# EAGLE design Active_rectifier (EAGLE 8.3.2)
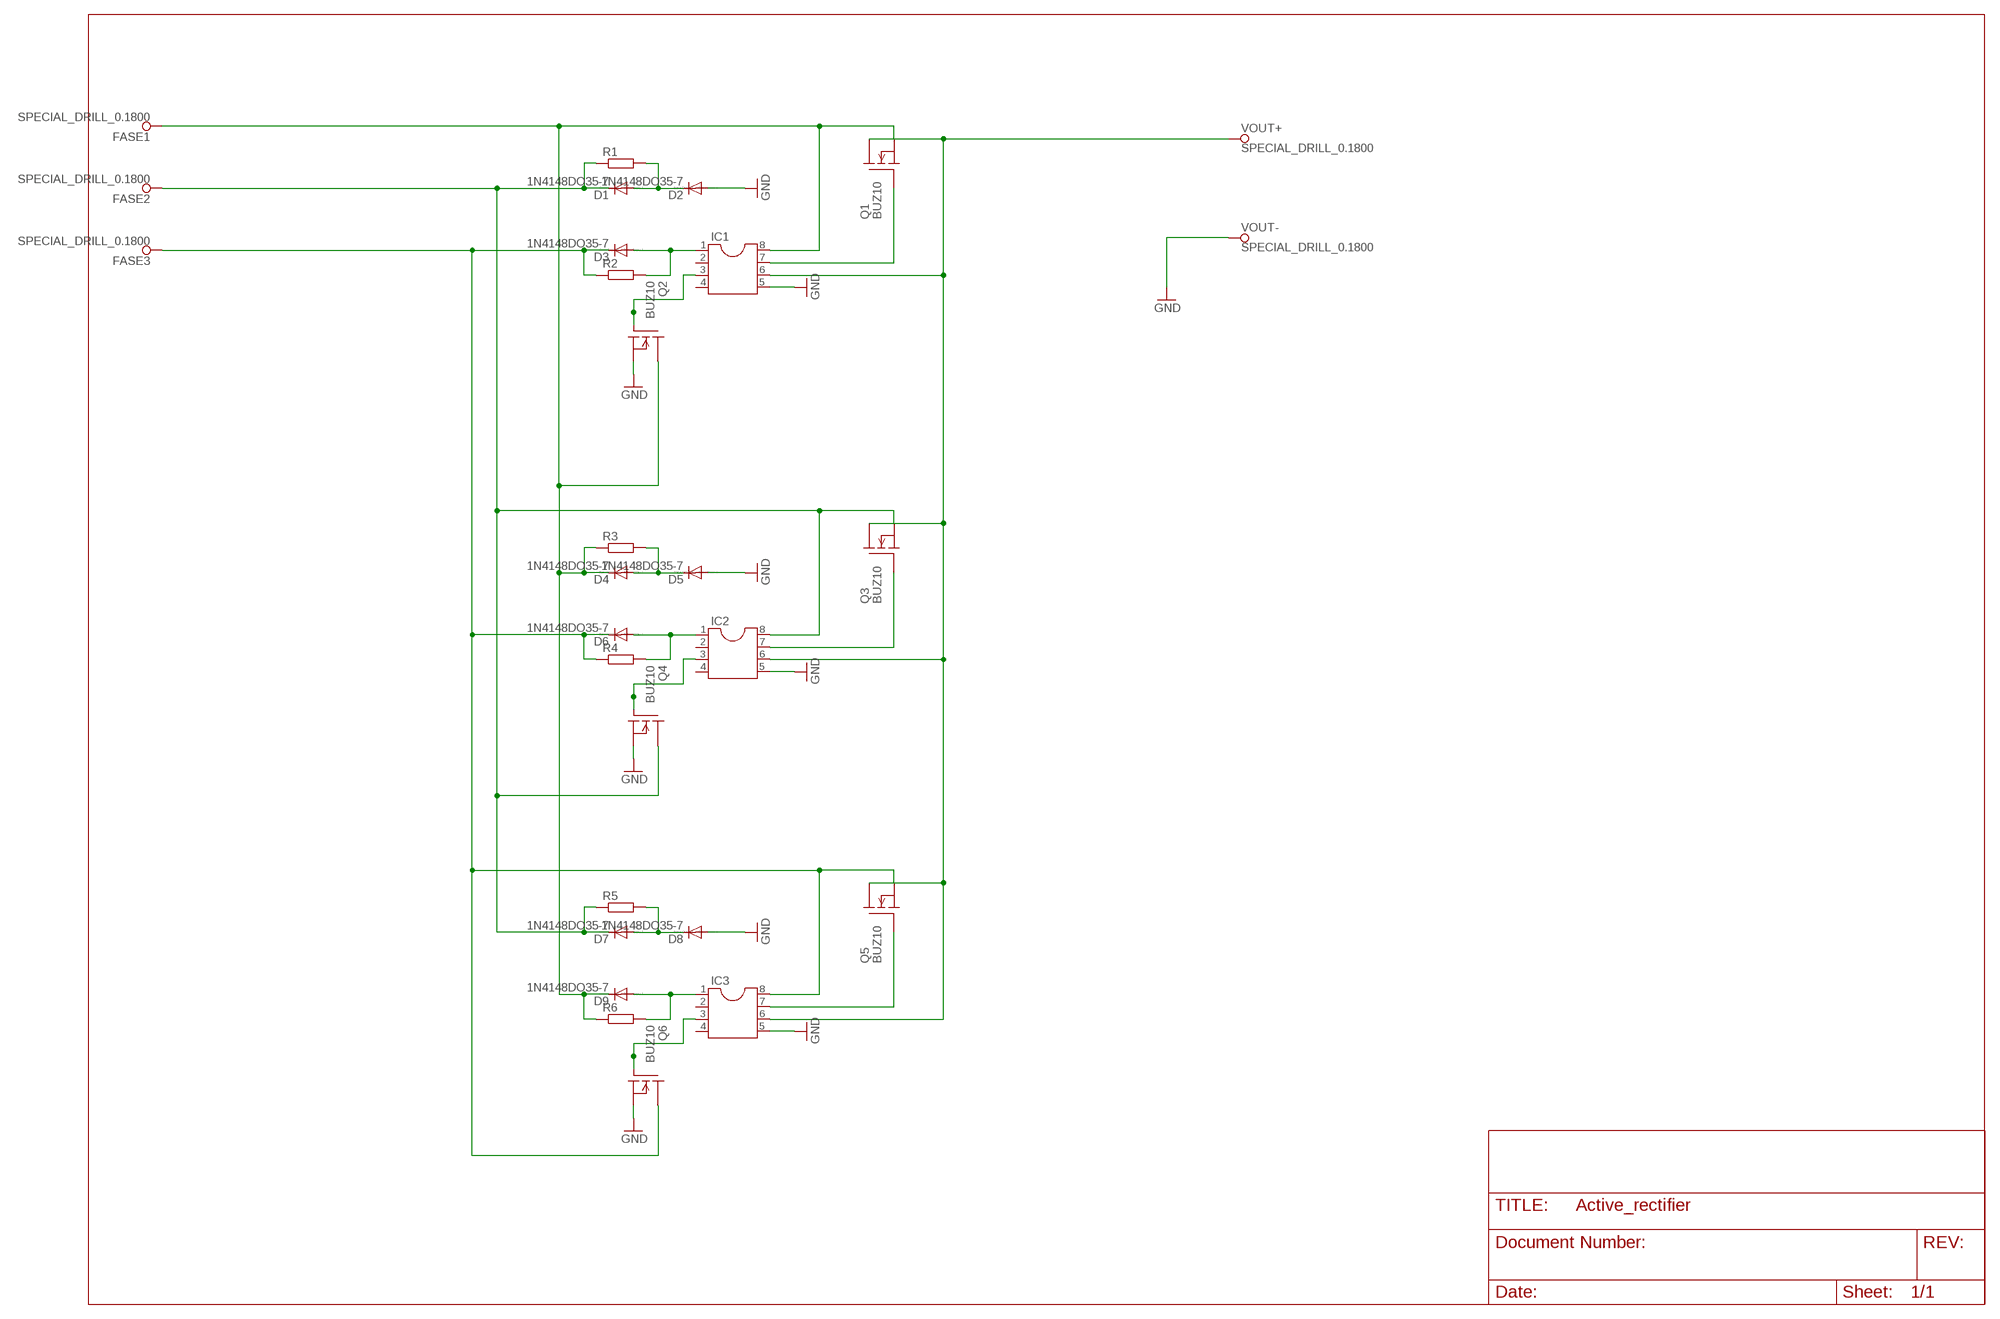
[diagram p0: schematic, sheet 1]

## Parts
D1  1N4148DO35-7  [DO35-7]
D2  1N4148DO35-7  [DO35-7]
D3  1N4148DO35-7  [DO35-7]
D4  1N4148DO35-7  [DO35-7]
D5  1N4148DO35-7  [DO35-7]
D6  1N4148DO35-7  [DO35-7]
D7  1N4148DO35-7  [DO35-7]
D8  1N4148DO35-7  [DO35-7]
D9  1N4148DO35-7  [DO35-7]
FASE1  SPECIAL_DRILL_0.1800  [PAD_0.1800]
FASE2  SPECIAL_DRILL_0.1800  [PAD_0.1800]
FASE3  SPECIAL_DRILL_0.1800  [PAD_0.1800]
IC1  DIL8  [DIL08]
IC2  DIL8  [DIL08]
IC3  DIL8  [DIL08]
Q1  BUZ10  [TO220]
Q2  BUZ10  [TO220]
Q3  BUZ10  [TO220]
Q4  BUZ10  [TO220]
Q5  BUZ10  [TO220]
Q6  BUZ10  [TO220]
R1  R-EU_0207/10  [0207/10]
R2  R-EU_0207/10  [0207/10]
R3  R-EU_0207/10  [0207/10]
R4  R-EU_0207/10  [0207/10]
R5  R-EU_0207/10  [0207/10]
R6  R-EU_0207/10  [0207/10]
VOUT+  SPECIAL_DRILL_0.1800  [PAD_0.1800]
VOUT-  SPECIAL_DRILL_0.1800  [PAD_0.1800]

## Nets
GND: D2.A D5.A D8.A IC1.5 IC2.5 IC3.5 Q2.3(S) Q4.3(S) Q6.3(S) VOUT-.1
N$1: D1.A D2.C R1.2
N$2: IC1.7 Q1.1(G)
N$3: D3.A IC1.1 R2.2
N$4: D4.A D5.C R3.2
N$6: IC1.3 Q2.1(G)
N$7: D6.A IC2.1 R4.2
N$8: D3.C D6.C FASE3.1 IC3.8 Q5.3(S) Q6.2(D) R2.1 R4.1
N$9: D7.A D8.C R5.2
N$10: D4.C D9.C FASE1.1 IC1.8 Q1.3(S) Q2.2(D) R3.1 R6.1
N$11: IC2.3 Q4.1(G)
N$12: D9.A IC3.1 R6.2
N$15: IC1.6 IC2.6 IC3.6 Q1.2(D) Q3.2(D) Q5.2(D) VOUT+.1
N$16: IC2.7 Q3.1(G)
N$17: D1.C D7.C FASE2.1 IC2.8 Q3.3(S) Q4.2(D) R1.1 R5.1
N$18: IC3.3 Q6.1(G)
N$20: IC3.7 Q5.1(G)
Unconnected: IC1.2 IC1.4 IC2.2 IC2.4 IC3.2 IC3.4

## Library data of the parts
D1-D9 = diode:1N4148: DIODE high speed (Philips)
FASE1-FASE3 VOUT+ VOUT- = special-drill:SPECIAL_DRILL_: Special drills
IC1-IC3 = ic-package:DIL8: Dual In Line / Socket
Q1-Q6 = transistor-fet:BUZ10: N-Channel Enhancement MOSFET 50V; 20A; 0,080Ohm
R1-R6 = !MyLib:R-EU_: RESISTOR, European symbol

## Board
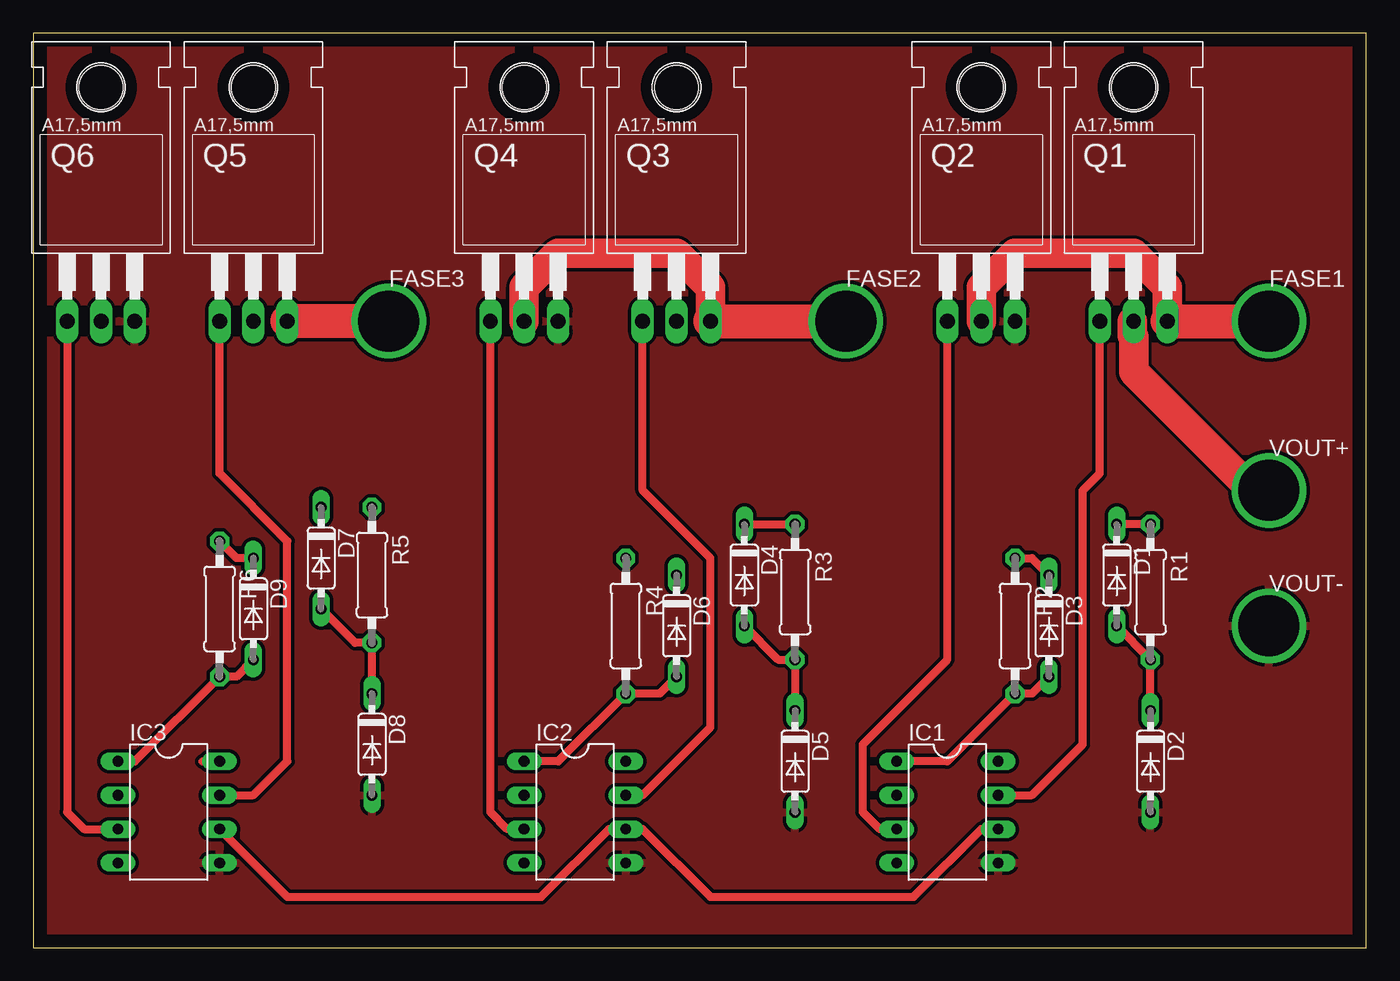
[diagram p1: board, top side]
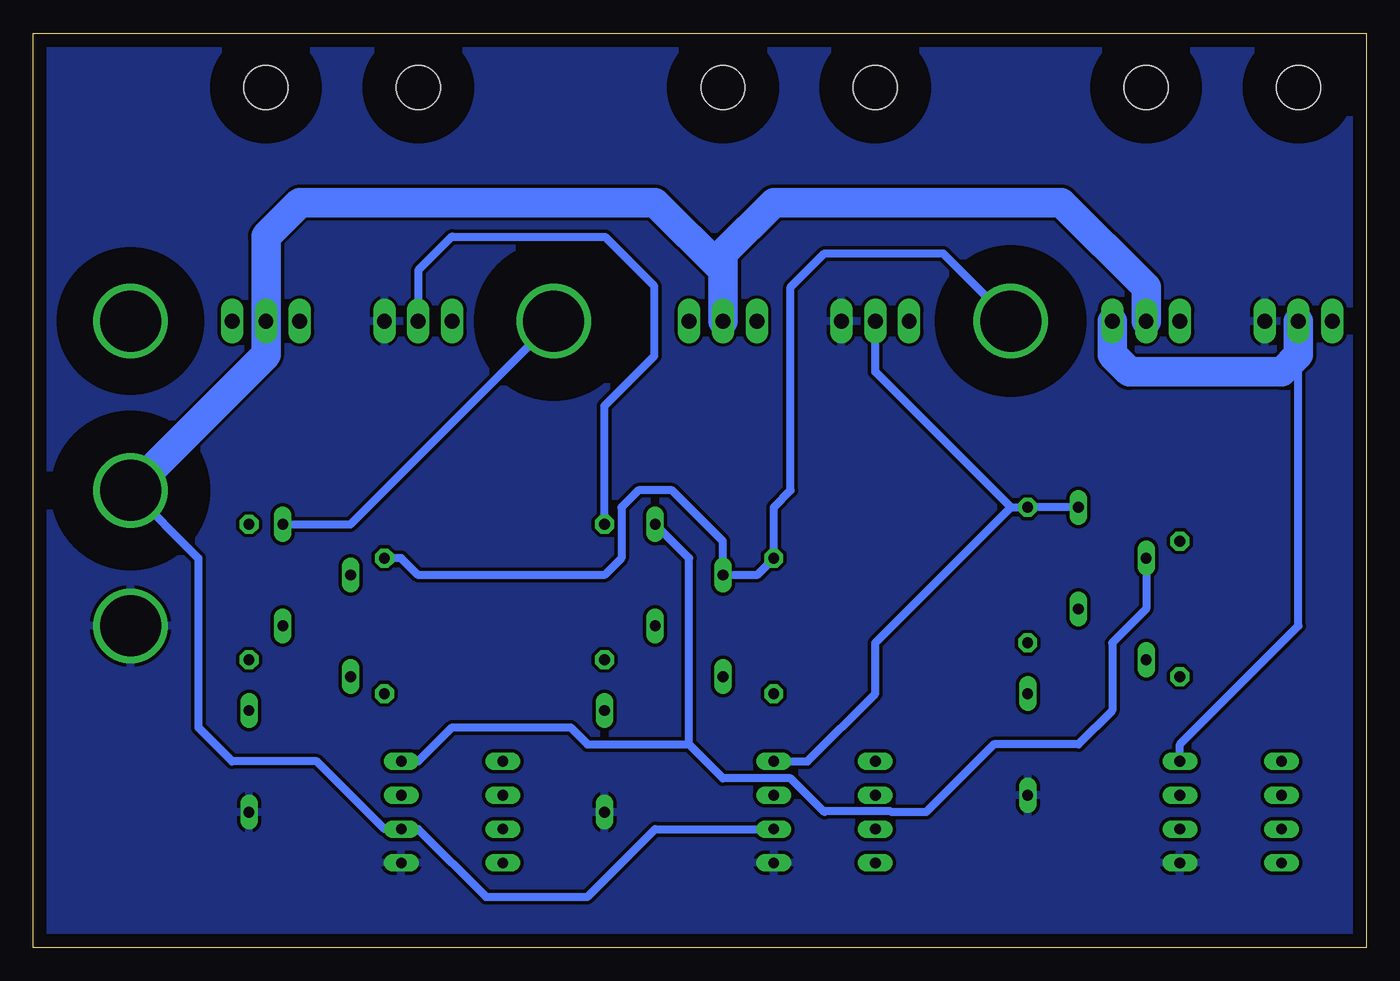
[diagram p2: board, bottom side, seen from below]

Size 100 x 68.57 mm. Coordinates in mm from the lower left corner, seen from the top.
Outline: 0,0 100,0 100,68.57 0,68.57 0,0
Copper layers (1*16): Top 0.035mm / dielectric 1.5mm / Bottom 0.035mm
Design rules "default *": minimum track width 6mil, minimum drill 0.35mm, track to track 10mil, track to pad 10mil, pad to pad 10mil, via to via 10mil, smd to smd 10mil, copper to edge 40mil, drill to drill 6mil, minimum pad ring 10mil, minimum via ring 8mil, stop-mask expansion 4mil, vias tented up to drill 0mil, thermal gap 10mil
bRestrict: area 21.3,41.6 to 32.1,52.4; area 55.3,41.3 to 66.6,52.7; area 87.5,41.8 to 97.9,52.2; area 87,28.6 to 98.4,40

### Footprints (pad centres in the part's own frame; a part is rotated, then mirrored left to right if it is on the bottom)
DO35-7 = drill 0.813 long: A 3.81,0; C -3.81,0
PAD_0.1800 = drill 4.572 pad 4.572: 1 0,0
DIL08 = drill 0.813 long: 1 -3.81,-3.81; 2 -1.27,-3.81; 3 1.27,-3.81; 4 3.81,-3.81; 5 3.81,3.81; 6 1.27,3.81; 7 -1.27,3.81; 8 -3.81,3.81
TO220 = drill 1.118 long: 1 -2.54,-6.35; 2 0,-6.35; 3 2.54,-6.35 | hole 3.302: 0,11.176
0207/10 = drill 0.813 pad 1.422 octagon: 1 -5.08,0; 2 5.08,0

### Placement (x,y rotation side)
D1  81.28,27.94 270 top
D2  83.82,13.97 270 top
D3  76.2,24.13 270 top
D4  53.34,27.94 270 top
D5  57.15,13.97 270 top
D6  48.26,24.13 270 top
D7  21.59,29.21 270 top
D8  25.4,15.24 270 top
D9  16.51,25.4 270 top
FASE1  92.71,46.99 0 top
FASE2  60.96,46.99 0 top
FASE3  26.67,46.99 0 top
IC1  68.58,10.16 270 top
IC2  40.64,10.16 270 top
IC3  10.16,10.16 270 top
Q1  82.55,53.34 0 top
Q2  71.12,53.34 0 top
Q3  48.26,53.34 0 top
Q4  36.83,53.34 0 top
Q5  16.51,53.34 0 top
Q6  5.08,53.34 0 top
R1  83.82,26.67 270 top
R2  73.66,24.13 270 top
R3  57.15,26.67 270 top
R4  44.45,24.13 270 top
R5  25.4,27.94 270 top
R6  13.97,25.4 270 top
VOUT+  92.71,34.29 0 top
VOUT-  92.71,24.13 0 top

### Tracks (layer width: path | path; a pad name or v marks a point on that pad's centre or on a via)
GND
  pour Bottom: 101.6,82.55 101.6,-1.27 -1.27,-1.27 -1.27,82.55
  pour Top: -1.27,81.28 -1.27,-1.27 101.6,-1.27 101.6,81.28
N$1
  Top 0.61: D2.C R1.2 D1.A
N$2
  Top 0.61: IC1.7 74.93,11.43 78.74,15.24 78.74,34.29 80.01,35.56 Q1.1
N$3
  Top 0.61: D3.A 74.93,19.05 R2.2 68.58,13.97 IC1.1
N$4
  Top 0.61: D4.A 55.88,21.59 R3.2 D5.C
N$6
  Top 0.61: IC1.3 63.5,8.89 62.23,10.16 62.23,15.24 68.58,21.59 Q2.1
N$7
  Top 0.61: D6.A 46.99,19.05 R4.2 39.37,13.97 IC2.1
N$8
  Top 0.61: R2.1 74.93,29.21 D3.C | IC3.8 12.7,13.97
  Top 2.54: FASE3.1 Q5.3
  Bottom 0.61: IC3.8 13.97,15.24 5.08,24.13 Q6.2 | R2.1 72.39,29.21 71.12,27.94 57.15,27.94 55.88,29.21 55.88,33.02 54.61,34.29 52.07,34.29 48.26,30.48 D6.C 45.72,27.94 R4.1 44.45,33.02 43.18,34.29 43.18,49.53 40.64,52.07 31.75,52.07 31.11,51.44 30.91,51.23 FASE3.1
  Bottom 2.2: Q6.2 5.08,44.45 6.35,43.18 17.78,43.18 19.05,44.45 Q5.3
N$9
  Top 0.61: D8.C R5.2 24.13,22.86 D7.A
N$10
  Top 0.61: D4.C R3.1 | D9.C 15.24,29.21 R6.1
  Top 2.2: Q2.2 71.12,49.53 73.66,52.07 82.55,52.07 85.09,49.53 Q1.3
  Top 2.54: Q1.3 FASE1.1
  Bottom 0.61: D9.C 16.51,25.4 19.05,22.86 19.05,17.78 21.59,15.24 27.94,15.24 33.02,10.16 35.61,10.16 35.66,10.21 40.59,10.21 40.64,10.16 43.18,12.7 48.26,12.7 50.8,15.24 | R3.1 57.15,40.64 53.4,44.38 53.4,49.59 57.09,53.28 68.52,53.28 68.58,53.34 71.12,50.8 Q2.2 | 50.8,15.24 50.8,29.21 D4.C | IC1.8 71.12,13.97 68.58,16.51 59.69,16.51 58.42,15.24 50.8,15.24
N$11
  Top 0.61: IC2.3 35.56,8.89 34.29,10.16 Q4.1
N$12
  Top 0.61: D9.A 15.24,20.32 R6.2 7.62,13.97 IC3.1
N$15
  Top 0.61: IC1.6 71.12,8.89 66.04,3.81 50.8,3.81 45.72,8.89 IC2.6 43.18,8.89 38.1,3.81 19.05,3.81 IC3.6
  Top 2.2: VOUT+.1 91.44,34.29 82.55,43.18 82.55,45.82 82.47,45.9 82.47,46.99
  Bottom 0.61: VOUT+.1 87.63,29.21 87.63,16.51 85.09,13.97 78.74,13.97 73.66,8.89 IC1.6 71.12,8.89 66.04,3.81 58.42,3.81 53.34,8.89 IC2.6
  Bottom 2.2: Q5.2 16.51,49.53 22.86,55.88 44.45,55.88 48.26,52.07 Q3.2 48.26,50.8 53.34,55.88 80.01,55.88 82.55,53.34 Q1.2 82.55,44.45 VOUT+.1
N$16
  Top 0.61: IC2.7 45.72,11.43 50.8,16.51 50.8,29.21 45.72,34.29 Q3.1
N$17
  Top 0.61: R1.1 D1.C
  Top 2.2: Q4.2 36.83,49.53 39.37,52.07 48.26,52.07 50.8,49.53 Q3.3
  Top 2.54: Q3.3 FASE2.1
  Bottom 0.61: D7.C R5.1 26.67,33.02 | 26.67,33.02 36.83,43.18 Q4.2 | IC2.8 41.91,13.97 36.83,19.05 36.83,22.86 26.67,33.02 | D1.C 76.2,31.75 66.04,41.91 65.41,42.54 FASE2.1
N$18
  Top 0.61: Q6.1 2.54,10.16 3.81,8.89 IC3.3
N$20
  Top 0.61: IC3.7 16.51,11.43 19.05,13.97 19.05,30.48 13.97,35.56 Q5.1